# Altium project Signal_Integrity_4L_Simplified.PrjPcb
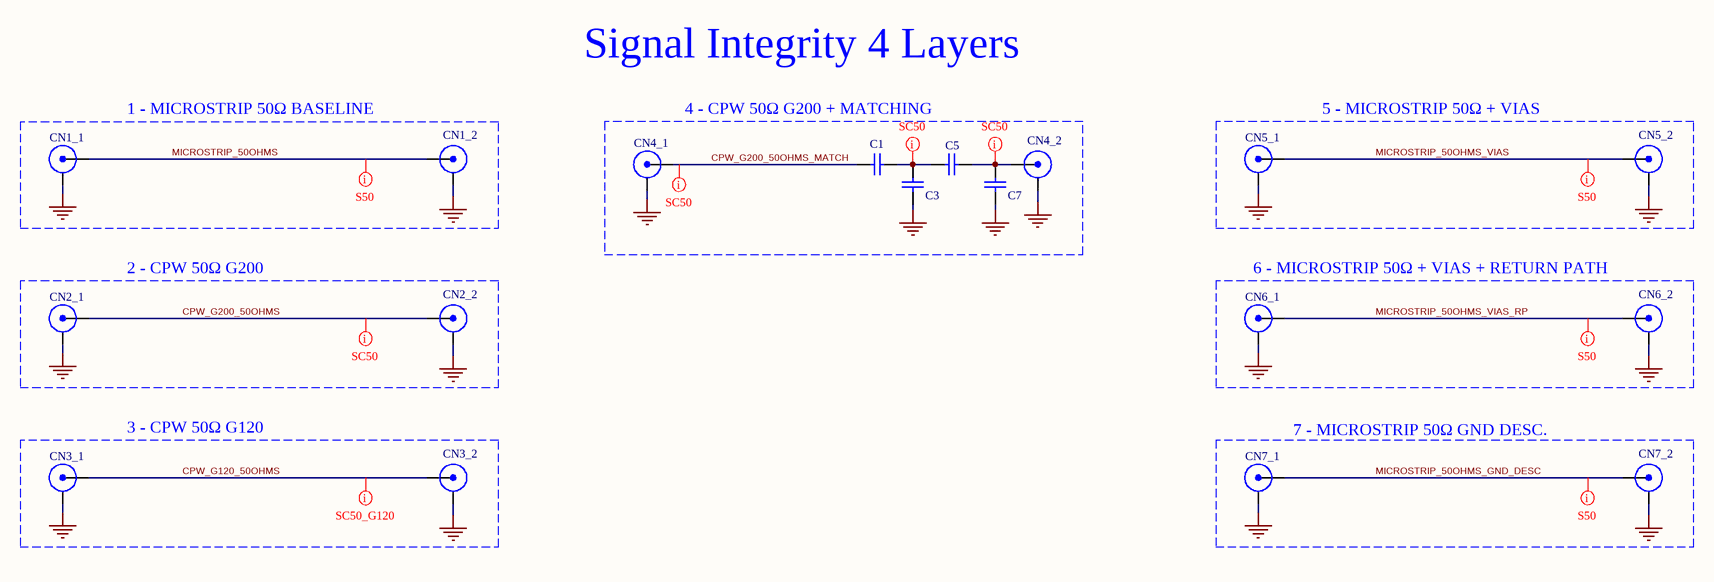
[diagram p0: Signal_Integrity_4L.SchDoc]
1 sheet, 18 parts. Net scope: global (net labels, ports and power ports of the same name join across sheets).
Board files: Signal_Integrity_4L.PcbDoc, Painel_Signal_Integrity_4L.PcbDoc

## Sheet Signal_Integrity_4L.SchDoc
size 420 x 297 mm; Tamanho: A4; ENG_APP_DATE: --/--/--; DSN_APP_DATE: --/--/--; CHK_APP_DATE: --/--/--; SheetNumber: 1; SheetTotal: 1

### Parts
C1  CAP SMD 0402  [0402]  (value not drawn)
C3  CAP SMD 0402  [0402]  (value not drawn)
C5  CAP SMD 0402  [0402]  (value not drawn)
C7  CAP SMD 0402  [0402]  (value not drawn)
CN1_1  SMA-KE EDGE  [SMA-KE EDGE]  (value not drawn)
CN1_2  SMA-KE EDGE  [SMA-KE EDGE]  (value not drawn)
CN2_1  SMA-KE EDGE  [SMA-KE EDGE]  (value not drawn)
CN2_2  SMA-KE EDGE  [SMA-KE EDGE]  (value not drawn)
CN3_1  SMA-KE EDGE  [SMA-KE EDGE]  (value not drawn)
CN3_2  SMA-KE EDGE  [SMA-KE EDGE]  (value not drawn)
CN4_1  SMA-KE EDGE  [SMA-KE EDGE]  (value not drawn)
CN4_2  SMA-KE EDGE  [SMA-KE EDGE]  (value not drawn)
CN5_1  SMA-KE EDGE  [SMA-KE EDGE]  (value not drawn)
CN5_2  SMA-KE EDGE  [SMA-KE EDGE]  (value not drawn)
CN6_1  SMA-KE EDGE  [SMA-KE EDGE]  (value not drawn)
CN6_2  SMA-KE EDGE  [SMA-KE EDGE]  (value not drawn)
CN7_1  SMA-KE EDGE  [SMA-KE EDGE]  (value not drawn)
CN7_2  SMA-KE EDGE  [SMA-KE EDGE]  (value not drawn)

### Blocks framed on the sheet
1 - MICROSTRIP 50Ω BASELINE: CN1_1 CN1_2
4 - CPW 50Ω G200 + MATCHING: C1 C3 C5 C7 CN4_1 CN4_2
5 - MICROSTRIP 50Ω + VIAS: CN5_1 CN5_2
2 - CPW 50Ω G200: CN2_1 CN2_2
6 - MICROSTRIP 50Ω + VIAS + RETURN PATH: CN6_1 CN6_2
3 - CPW 50Ω G120: CN3_1 CN3_2
7 - MICROSTRIP 50Ω GND DESC.: CN7_1 CN7_2

### Nets
GND1: CN1_1.2(GND) CN1_2.2(GND)
GND2: CN2_1.2(GND) CN2_2.2(GND)
GND3: CN3_1.2(GND) CN3_2.2(GND)
GND4: C3.1 C7.1 CN4_1.2(GND) CN4_2.2(GND)
GND5: CN5_1.2(GND) CN5_2.2(GND)
GND6: CN6_1.2(GND) CN6_2.2(GND)
GND7: CN7_1.2(GND) CN7_2.2(GND)
CPW_G120_50OHMS: CN3_1.1(SIGNAL) CN3_2.1(SIGNAL)
CPW_G200_50OHMS: CN2_1.1(SIGNAL) CN2_2.1(SIGNAL)
CPW_G200_50OHMS_MATCH: C1.1 CN4_1.1(SIGNAL)
MICROSTRIP_50OHMS: CN1_1.1(SIGNAL) CN1_2.1(SIGNAL)
MICROSTRIP_50OHMS_GND_DESC: CN7_1.1(SIGNAL) CN7_2.1(SIGNAL)
MICROSTRIP_50OHMS_VIAS: CN5_1.1(SIGNAL) CN5_2.1(SIGNAL)
MICROSTRIP_50OHMS_VIAS_RP: CN6_1.1(SIGNAL) CN6_2.1(SIGNAL)
NetC1_2: C1.2 C3.2 C5.1
NetC5_2: C5.2 C7.2 CN4_2.1(SIGNAL)

### Layout directives
net class S50: MICROSTRIP_50OHMS, MICROSTRIP_50OHMS_GND_DESC, MICROSTRIP_50OHMS_VIAS, MICROSTRIP_50OHMS_VIAS_RP
net class SC50: CPW_G200_50OHMS, CPW_G200_50OHMS_MATCH, NetC1_2, NetC5_2
net class SC50_G120: CPW_G120_50OHMS

### Notes on the sheet
- Signal Integrity 4 Layers

### Library data of the parts
C1 C3 C5 C7 = CAP SMD 0402: 0402
CN1_1 CN1_2 CN2_1 CN2_2 CN3_1 CN3_2 CN4_1 CN4_2 CN5_1 CN5_2 CN6_1 CN6_2 CN7_1 CN7_2 = SMA-KE EDGE: SMA Connector Receptacle, Female Socket 50Ohm Board Edge, End Launch Solder; Manufacturer_Name: TE Connectivity; Manufacturer_Part_Number: CONSMA020.062-G; Geometry.Height: 7.92mm; Mouser Part Number: 712-CONSMA020.062-G; Mouser Price/Stock: https://www.mouser.co.uk/ProductDetail/Linx-Technologies/CONSMA020.062-G?qs=xZ%2FP%252Ba9zWqa7zEs9%2FuMaNQ%3D%3D; Datasheet Link: https://componentsearchengine.com/Datasheets/1/CONSMA020.062-G.pdf